# EAGLE board canSlaveV04 (EAGLE 6.5.0)
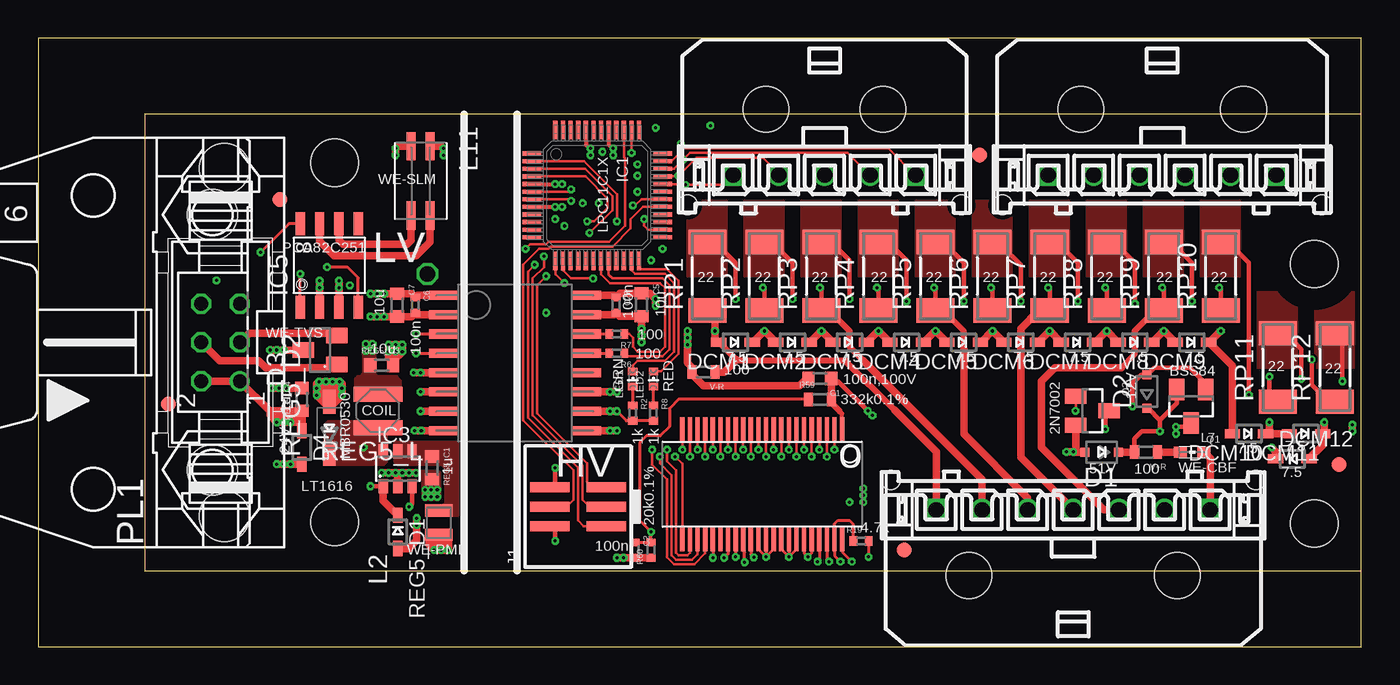
[diagram p5: board, top side]
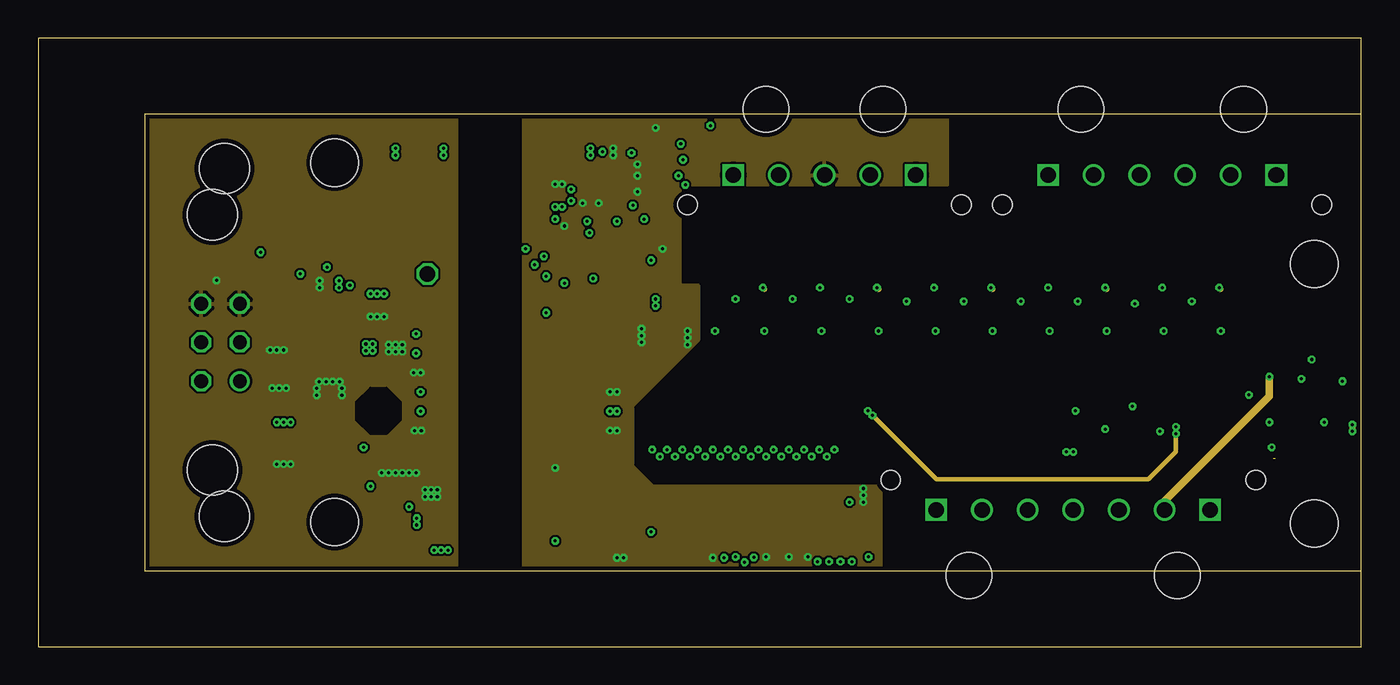
[diagram p6: board, inner layer Route2]
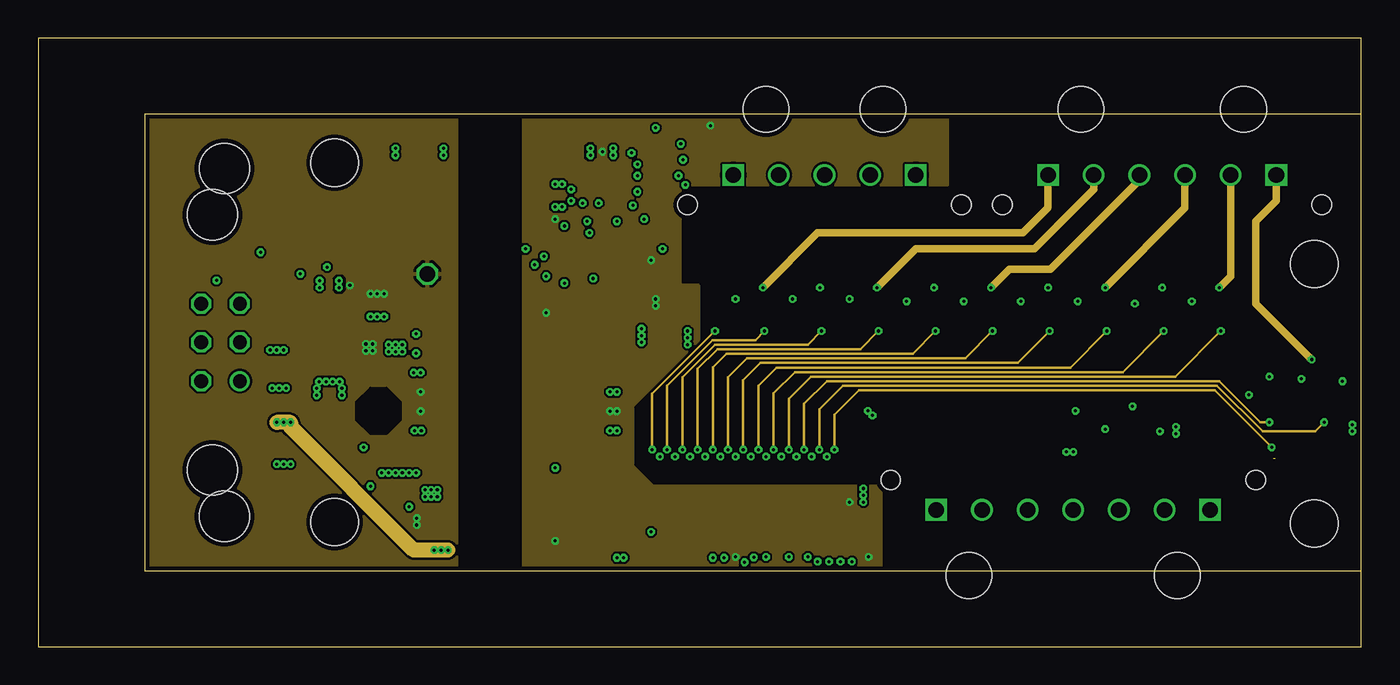
[diagram p7: board, inner layer Route15]
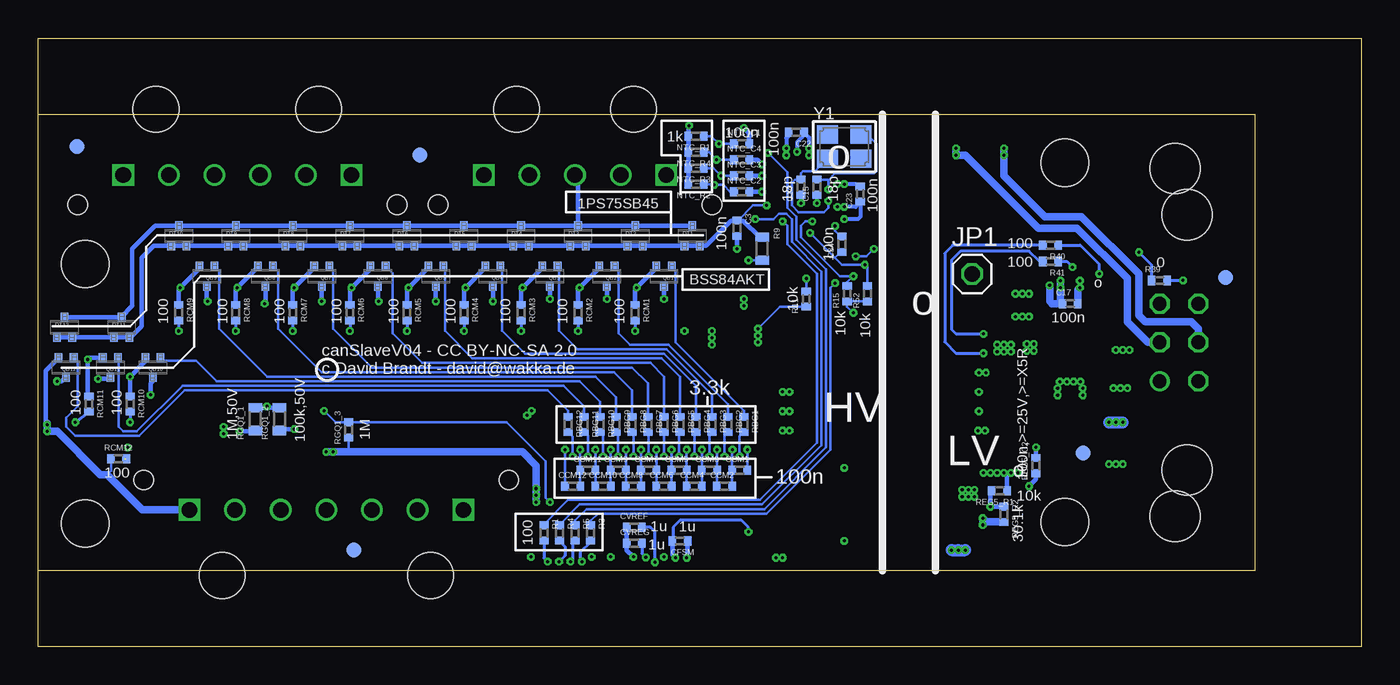
[diagram p8: board, bottom side, seen from below]

Size 87 x 40 mm. Coordinates in mm from the lower left corner, seen from the top.
Outline: 87,5 7,5 7,35 87,35
Outline: 87,5 87,35
Outline: 87,35 87,40 0,40 0,0 87,0 87,5
Copper layers (1+2*15+16): Top 0.035mm / dielectric 0.38mm / Route2 0.035mm / dielectric 0.71mm / Route15 0.035mm / dielectric 0.38mm / Bottom 0.035mm
Design rules "PCB-POOL Standard_ML4 *": minimum track width 0.15mm, minimum drill 0.2mm, track to track 0.15mm, track to pad 0.15mm, pad to pad 0.15mm, via to via 0.15mm, smd to smd 0mil, copper to edge 0.3mm, drill to drill 0.2mm, minimum pad ring 0.2mm, minimum via ring 0.15mm, stop-mask expansion 0.075mm, vias tented up to drill 0.31mm, thermal gap 0.2mm
Holes 3.1 mm at 19.5,8.2 19.5,31.8 83.9,8.1 83.9,25.15
tRestrict: area 16.5,5.2 to 22.5,11.2; area 16.5,28.8 to 22.5,34.8; area 80.9,5.1 to 86.9,11.1; area 80.9,22.1 to 86.9,28.1; 1 lines
bRestrict: area 16.5,5.2 to 22.5,11.2; area 16.5,28.8 to 22.5,34.8; area 80.9,5.1 to 86.9,11.1; area 80.9,22.1 to 86.9,28.1; 1 lines

## Footprints (pad centres in the part's own frame; a part is rotated, then mirrored left to right if it is on the bottom)
C0603 = smd 0.8 x 0.9: 1 -0.75,0; 2 0.75,0
C0402 = smd 0.5 x 0.6: 1 -0.5,0; 2 0.5,0
SOD323-R = smd 0.6 x 0.6: A 1.1,0; C -1.1,0
WE-TVS_SOT23-3L = smd 1 x 1.4: 1 -0.95,-1.1; 2 0.95,-1.1; 3 0,1.1
SOD323 = smd 1 x 0.6: 1 -1.1,0; 2 1.1,0
SOD323-L = smd 1 x 0.6: A 1.1,0; C -1.1,0
SOT416 = smd 0.5 x 0.6: 1 -0.5,-0.65; 2 0.5,-0.65; 3 0,0.65
FIDUCIAL_1MM = smd 1 x 1: 1 0,0
LQFP48 = smd 0.28 x 1.2: 1 -2.75,-4.3; 2 -2.25,-4.3; 3 -1.75,-4.3; 4 -1.25,-4.3; 5 -0.75,-4.3; 6 -0.25,-4.3; 7 0.25,-4.3; 8 0.75,-4.3; 9 1.25,-4.3; 10 1.75,-4.3; 11 2.25,-4.3; 12 2.75,-4.3; 25 2.75,4.3; 26 2.25,4.3; 27 1.75,4.3; 28 1.25,4.3; 29 0.75,4.3; 30 0.25,4.3; 31 -0.25,4.3; 32 -0.75,4.3; 33 -1.25,4.3; 34 -1.75,4.3; 35 -2.25,4.3; 36 -2.75,4.3 | smd 1.2 x 0.28: 13 4.3,-2.75; 14 4.3,-2.25; 15 4.3,-1.75; 16 4.3,-1.25; 17 4.3,-0.75; 18 4.3,-0.25; 19 4.3,0.25; 20 4.3,0.75; 21 4.3,1.25; 22 4.3,1.75; 23 4.3,2.25; 24 4.3,2.75; 37 -4.3,2.75; 38 -4.3,2.25; 39 -4.3,1.75; 40 -4.3,1.25; 41 -4.3,0.75; 42 -4.3,0.25; 43 -4.3,-0.25; 44 -4.3,-0.75; 45 -4.3,-1.25; 46 -4.3,-1.75; 47 -4.3,-2.25; 48 -4.3,-2.75
44SSOP = smd 1.6 x 0.28: 1 -3.6,5.25; 2 -3.6,4.75; 3 -3.6,4.25; 4 -3.6,3.75; 5 -3.6,3.25; 6 -3.6,2.75; 7 -3.6,2.25; 8 -3.6,1.75; 9 -3.6,1.25; 10 -3.6,0.75; 11 -3.6,0.25; 12 -3.6,-0.25; 13 -3.6,-0.75; 14 -3.6,-1.25; 15 -3.6,-1.75; 16 -3.6,-2.25; 17 -3.6,-2.75; 18 -3.6,-3.25; 19 -3.6,-3.75; 20 -3.6,-4.25; 21 -3.6,-4.75; 22 -3.6,-5.25; 23 3.6,-5.25; 24 3.6,-4.75; 25 3.6,-4.25; 26 3.6,-3.75; 27 3.6,-3.25; 28 3.6,-2.75; 29 3.6,-2.25; 30 3.6,-1.75; 31 3.6,-1.25; 32 3.6,-0.75; 33 3.6,-0.25; 34 3.6,0.25; 35 3.6,0.75; 36 3.6,1.25; 37 3.6,1.75; 38 3.6,2.25; 39 3.6,2.75; 40 3.6,3.25; 41 3.6,3.75; 42 3.6,4.25; 43 3.6,4.75; 44 3.6,5.25
SOT23-6 = smd 0.6 x 0.9: 1 -0.95,-1.15; 2 0,-1.15; 3 0.95,-1.15; 4 0.95,1.15; 5 0,1.15; 6 -0.95,1.15
SO-8 = smd 1.524 x 0.61: 1 -2.743,1.905; 2 -2.743,0.635; 3 -2.743,-0.635; 4 -2.743,-1.905; 5 2.743,-1.905; 6 2.743,-0.635; 7 2.743,0.635; 8 2.743,1.905
2X03_1.27MM_SMT = smd 0.65 x 2.6: 1 -1.27,-1.85; 2 -1.27,1.85; 3 0,-1.85; 4 0,1.85; 5 1.27,-1.85; 6 1.27,1.85
1X01 = drill 1.016 octagon: 1 0,0
WE-PMI_0806 = smd 0.8 x 1.8: 1 -0.8,0; 2 0.8,0
0603 = smd 0.85 x 0.7: 1 -0.775,0; 2 0.775,0
WE-SLM = smd 1.85 x 0.6: 1 -2.28,0.63; 2 -2.28,-0.62; 3 2.27,-0.62; 4 2.27,0.63
CHIPLED_0402 = smd 0.6 x 0.5: A 0,-0.5; C 0,0.5
R0402 = smd 0.5 x 0.6: 1 -0.5,0; 2 0.5,0
06V = drill 0.914: 1 -2.54,-1.27 | drill 0.914 octagon: 2 -2.54,1.27; 3 0,-1.27; 4 0,1.27; 5 2.54,-1.27; 6 2.54,1.27 | hole 3.302: 11.43,-0.254; -11.43,-0.254
06H = drill 0.914: 1 -2.54,-1.27 | drill 0.914 octagon: 2 -2.54,1.27; 3 0,-1.27; 4 0,1.27; 5 2.54,-1.27; 6 2.54,1.27 | hole 3.302: -8.382,0.533; 8.382,0.533
SOT23 = smd 1 x 1.4: 1 -0.95,-1.1; 2 0.95,-1.1; 3 0,1.1
R0603 = smd 0.6 x 0.9: 1 -0.75,0; 2 0.75,0
SOD123 = smd 1.6 x 0.8: 1 -1.7,0; 2 1.7,0
WE-TPC_2828 = smd 3.2 x 1: 1 0,1.1; 2 0,-1.1
MINI_MELF-0207R = smd 1.6 x 2.5: 1 -2.25,0; 2 2.25,0
SO16WB = smd 1.9 x 0.6: P$1 -4.7,4.445; P$2 -4.7,3.175; P$3 -4.7,1.905; P$4 -4.7,0.635; P$5 -4.7,-0.635; P$6 -4.7,-1.905; P$7 -4.7,-3.175; P$8 -4.7,-4.445; P$9 4.7,-4.445; P$10 4.7,-3.175; P$11 4.7,-1.905; P$12 4.7,-0.635; P$13 4.7,0.635; P$14 4.7,1.905; P$15 4.7,3.175; P$16 4.7,4.445
43650-0500 = drill 1.02 square: 1 6,4.32 | drill 1.02: 2 3,4.32; 3 0,4.32; 4 -3,4.32; 5 -6,4.32 | hole 3: 3.85,0; -3.85,0
43650-0515 = drill 1.02 square: 1 6,0 | drill 1.02: 2 3,0; 3 0,0; 4 -3,0; 5 -6,0 | hole 1.27: 9,-1.96; -9,-1.96
43650-0700 = drill 1.02 square: 1 9,4.32 | drill 1.02: 2 6,4.32; 3 3,4.32; 4 0,4.32; 5 -3,4.32; 6 -6,4.32; 7 -9,4.32 | hole 3: 6.85,0; -6.85,0
43650-0715 = drill 1.02 square: 1 9,0 | drill 1.02: 2 6,0; 3 3,0; 4 0,0; 5 -3,0; 6 -6,0; 7 -9,0 | hole 1.27: 12,-1.96; -12,-1.96
43650-0615 = drill 1.02 square: 1 7.5,0 | drill 1.02: 2 4.5,0; 3 1.5,0; 4 -1.5,0; 5 -4.5,0; 6 -7.5,0 | hole 1.27: 10.5,-1.96; -10.5,-1.96
43650-0600 = drill 1.02 square: 1 7.5,4.32 | drill 1.02: 2 4.5,4.32; 3 1.5,4.32; 4 -1.5,4.32; 5 -4.5,4.32; 6 -7.5,4.32 | hole 3: 5.35,0; -5.35,0
CRYSTAL_3.2X2.5 = smd 1.4 x 1.2: 1 -1.1,-0.8; 2 1.1,0.8; GND1 -1.1,0.8; GND2 1.1,-0.8

## Placement (x,y rotation side)
C1  100n,100V  [C0603]  51.39,17.63 180 top
C2  100n  [C0402]  39.25,6.35 270 top
C3  100n  [C0402]  41.05,27.5 270 bottom
C5  10u  [C0603]  39.67,22.48 270 top
C6  100n  [C0402]  24.8,22.45 270 top
C7  10u  [C0603]  23.6,22.45 270 top
C14  18p  [C0402]  36.85,30.2 90 bottom
C15  18p  [C0402]  35.8,30.2 90 bottom
C17  100n  [C0402]  19.15,22.55 0 bottom
C22  100n  [C0402]  37.15,33.8 180 bottom
C23  100n  [C0402]  32.95,29.75 90 bottom
C27  100n  [C0402]  38,22.45 270 top
C34  100n  [C0402]  34.15,26.45 90 bottom
CCM1  100n  [C0402]  40.88,11.6 0 bottom
CCM2  100n  [C0402]  41.88,10.55 0 bottom
CCM3  100n  [C0402]  42.86,11.6 0 bottom
CCM4  100n  [C0402]  43.86,10.55 0 bottom
CCM5  100n  [C0402]  44.86,11.6 0 bottom
CCM6  100n  [C0402]  45.86,10.55 0 bottom
CCM7  100n  [C0402]  46.86,11.6 0 bottom
CCM8  100n  [C0402]  47.86,10.55 0 bottom
CCM9  100n  [C0402]  48.86,11.6 0 bottom
CCM10  100n  [C0402]  49.86,10.55 0 bottom
CCM11  100n  [C0402]  50.86,11.6 0 bottom
CCM12  100n  [C0402]  51.86,10.55 0 bottom
CFSM  1u  [C0402]  44.8,6.95 180 bottom
CVREF  1u  [C0402]  47.8,7.85 0 bottom
CVREG  1u  [C0402]  47.8,6.8 0 bottom
D1  51V  [SOD323-R]  69.91,12.78 180 top
D2  12V  [SOD323-R]  72.89,16.76 90 top
D3  WE-TVS_824022  [WE-TVS_SOT23-3L]  18.55,19.5 90 top
D4  24V  [SOD323]  17.35,13.1 270 top
DCM1  7.5  [SOD323-L]  45.85,20 180 top
DCM2  7.5  [SOD323-L]  49.6,20 180 top
DCM3  7.5  [SOD323-L]  53.35,20 180 top
DCM4  7.5  [SOD323-L]  57.1,20 180 top
DCM5  7.5  [SOD323-L]  60.85,20 180 top
DCM6  7.5  [SOD323-L]  64.6,20 180 top
DCM7  7.5  [SOD323-L]  68.35,20 180 top
DCM8  7.5  [SOD323-L]  72.1,20 180 top
DCM9  7.5  [SOD323-L]  75.85,20 180 top
DCM10  7.5  [SOD323-L]  79.6,14 180 top
DCM11  7.5  [SOD323-L]  83.35,14 180 top
DCM12  7.5  [SOD323-L]  82.45,12.35 0 top
DT1  1PS75SB45  [SOT416]  44,27 0 bottom
DT2  1PS75SB45  [SOT416]  47.75,27 0 bottom
DT3  1PS75SB45  [SOT416]  51.5,27 0 bottom
DT4  1PS75SB45  [SOT416]  55.25,27 0 bottom
DT5  1PS75SB45  [SOT416]  59,27 0 bottom
DT6  1PS75SB45  [SOT416]  62.75,27 0 bottom
DT7  1PS75SB45  [SOT416]  66.5,27 0 bottom
DT8  1PS75SB45  [SOT416]  70.25,27 0 bottom
DT9  1PS75SB45  [SOT416]  74,27 0 bottom
DT10  1PS75SB45  [SOT416]  77.75,27 0 bottom
DT11  1PS75SB45  [SOT416]  81.5,21 0 bottom
DT12  1PS75SB45  [SOT416]  85.25,21 0 bottom
FID1  FIDUCIAL""  [FIDUCIAL_1MM]  15.9,29.39 0 top
FID2  FIDUCIAL""  [FIDUCIAL_1MM]  8.58,15.96 0 top
FID3  FIDUCIAL""  [FIDUCIAL_1MM]  85.52,11.98 0 top
FID4  FIDUCIAL""  [FIDUCIAL_1MM]  61.9,32.3 0 top
FID5  FIDUCIAL""  [FIDUCIAL_1MM]  56.95,6.35 0 top
FID6  FIDUCIAL""  [FIDUCIAL_1MM]  18.29,12.74 270 bottom
FID7  FIDUCIAL""  [FIDUCIAL_1MM]  84.43,32.87 0 bottom
FID8  FIDUCIAL""  [FIDUCIAL_1MM]  8.92,24.26 0 bottom
FID9  FIDUCIAL""  [FIDUCIAL_1MM]  61.9,32.3 0 bottom
FID10  FIDUCIAL""  [FIDUCIAL_1MM]  66.25,6.35 0 bottom
IC1  LPC11C1X  [LQFP48]  36.76,29.66 270 top
IC2  LTC6803-4  [44SSOP]  47.61,10.67 270 top
IC3  LT1616  [SOT23-6]  23.65,11.7 0 top
IC5  PCA82C251  [SO-8]  19.15,25.06 90 top
J1  PINHEAD-2X031.27SMT  [2X03_1.27MM_SMT]  35.5,9.2 90 top
JP1  [1X01]  25.6,24.5 0 bottom
L2  WE-PMI_0806  [WE-PMI_0806]  26.35,8.15 90 top
L7  WE-CBF_0603  [0603]  75.87,12.78 180 top
L11  WE-SLM  [WE-SLM]  25.15,30.61 270 top
LED1  GRN  [CHIPLED_0402]  39.1,17.6 0 top
LED2  RED  [CHIPLED_0402]  40.45,17.6 0 top
NTC_C1  100n  [C0402]  40.75,33.05 0 bottom
NTC_C2  100n  [C0402]  40.75,29.9 0 bottom
NTC_C3  100n  [C0402]  40.75,30.95 0 bottom
NTC_C4  100n  [C0402]  40.75,32 0 bottom
NTC_R1  1k  [R0402]  43.75,33.55 180 bottom
NTC_R2  1k  [R0402]  43.75,30.4 180 bottom
NTC_R3  1k  [R0402]  43.75,31.45 180 bottom
NTC_R4  1k  [R0402]  43.75,32.5 180 bottom
PL1  [06V]  12,20 90 top
PL2  [06H]  12,20 90 top
Q1  BSS84  [SOT23]  75.8,15.81 180 top
Q2  2N7002  [SOT23]  69.32,15.51 270 top
QB1  BSS84AKT  [SOT416]  45.85,24.35 180 bottom
QB2  BSS84AKT  [SOT416]  49.6,24.35 180 bottom
QB3  BSS84AKT  [SOT416]  53.35,24.35 180 bottom
QB4  BSS84AKT  [SOT416]  57.1,24.35 180 bottom
QB5  BSS84AKT  [SOT416]  60.85,24.35 180 bottom
QB6  BSS84AKT  [SOT416]  64.65,24.35 180 bottom
QB7  BSS84AKT  [SOT416]  68.35,24.35 180 bottom
QB8  BSS84AKT  [SOT416]  72.05,24.35 180 bottom
QB9  BSS84AKT  [SOT416]  75.9,24.35 180 bottom
QB10  BSS84AKT  [SOT416]  79.45,18.35 180 bottom
QB11  BSS84AKT  [SOT416]  82.25,18.35 180 bottom
QB12  BSS84AKT  [SOT416]  85.15,18.35 180 bottom
R1  100  [R0402]  53.74,7.48 270 bottom
R2  1k  [R0402]  39.1,15.35 270 top
R3  100  [R0402]  50.68,7.48 270 bottom
R4  100  [R0402]  52.72,7.48 270 bottom
R5  100  [R0402]  51.7,7.48 270 bottom
R6  100  [R0402]  38.05,19.29 180 top
R7  100  [R0402]  38.05,20.55 180 top
R8  1k  [R0402]  40.45,15.35 270 top
R9  [R0603]  39.4,26.15 270 bottom
R11  10k  [R0402]  36.5,22.85 90 bottom
R15  10k  [R0402]  33.81,23.2 90 bottom
R19  4.7k  [R0402]  54.1,6.95 0 top
R39  0  [R0402]  13.29,24.07 0 bottom
R40  100  [R0402]  20.44,26.39 180 bottom
R41  100  [R0402]  20.44,25.32 180 bottom
R52  10k  [R0402]  32.48,23.2 90 bottom
R59  332k0.1%  [R0603]  51.4,16.25 0 top
R60  20k0.1%  [R0402]  40.3,6.35 90 top
RBG1  3.3k  [R0402]  40.6,14.6 270 bottom
RBG2  3.3k  [R0402]  41.65,14.6 270 bottom
RBG3  3.3k  [R0402]  42.7,14.6 270 bottom
RBG4  3.3k  [R0402]  43.75,14.6 270 bottom
RBG5  3.3k  [R0402]  44.8,14.6 270 bottom
RBG6  3.3k  [R0402]  45.85,14.6 270 bottom
RBG7  3.3k  [R0402]  46.9,14.6 270 bottom
RBG8  3.3k  [R0402]  47.95,14.6 270 bottom
RBG9  3.3k  [R0402]  49,14.6 270 bottom
RBG10  3.3k  [R0402]  50.05,14.6 270 bottom
RBG11  3.3k  [R0402]  51.1,14.6 270 bottom
RBG12  3.3k  [R0402]  52.15,14.6 270 bottom
RCM1  100  [R0402]  47.75,21.95 270 bottom
RCM2  100  [R0402]  51.5,21.95 270 bottom
RCM3  100  [R0402]  55.25,21.95 270 bottom
RCM4  100  [R0402]  59,21.95 270 bottom
RCM5  100  [R0402]  62.75,21.95 270 bottom
RCM6  100  [R0402]  66.5,21.95 270 bottom
RCM7  100  [R0402]  70.25,21.95 270 bottom
RCM8  100  [R0402]  74,21.95 270 bottom
RCM9  100  [R0402]  77.75,21.95 270 bottom
RCM10  100  [R0402]  80.95,15.95 270 bottom
RCM11  100  [R0402]  83.65,15.95 270 bottom
RCM12  100  [R0402]  81.7,12.35 0 bottom
REG5_C1  1u,>=25V,>=X5R  [C0603]  25.9,11.75 270 top
REG5_C2  100n,>=25V,>=X5R  [C0402]  21.4,11.9 90 bottom
REG5_C3  10u,>=10V,>=X5R  [C0603]  22.6,18.5 0 top
REG5_C4  1u,>=25V,>=X5R  [C0603]  17.35,16.25 90 top
REG5_D1  [SOD323]  23.65,7.55 270 top
REG5_D2  MBR0530  [SOD123]  19.15,14.4 90 top
REG5_L  744025100  [WE-TPC_2828]  22.35,15.5 180 top
REG5_R1  10k  [R0402]  23.8,10.25 180 bottom
REG5_R2  30.1k  [R0402]  23.5,8.7 270 bottom
RGQ1_1  1M,50V  [R0603]  72.72,14.96 90 bottom
RGQ1_2  100k,50V  [R0603]  71.12,14.96 90 bottom
RGQ1_3  1M  [R0402]  66.57,14.25 90 bottom
RP1  22  [MINI_MELF-0207R]  44,24.35 90 top
RP2  22  [MINI_MELF-0207R]  47.75,24.35 90 top
RP3  22  [MINI_MELF-0207R]  51.5,24.35 90 top
RP4  22  [MINI_MELF-0207R]  55.25,24.35 90 top
RP5  22  [MINI_MELF-0207R]  59,24.35 90 top
RP6  22  [MINI_MELF-0207R]  62.75,24.35 90 top
RP7  22  [MINI_MELF-0207R]  66.5,24.35 90 top
RP8  22  [MINI_MELF-0207R]  70.25,24.35 90 top
RP9  22  [MINI_MELF-0207R]  74,24.35 90 top
RP10  22  [MINI_MELF-0207R]  77.75,24.35 90 top
RP11  22  [MINI_MELF-0207R]  81.5,18.35 90 top
RP12  22  [MINI_MELF-0207R]  85.25,18.35 90 top
U$2  ADUM5201  [SO16WB]  31.35,18.65 0 top
V+R  100  [R0603]  72.83,12.79 180 top
V-R  100  [R0603]  43.75,18.05 180 top
X1  [43650-0500]  51.7,35.32 180 top
X2  [43650-0515]  51.7,31 0 top
X3  [43650-0700]  68.05,4.68 0 top
X4  [43650-0715]  68.05,9 180 top
X5  [43650-0615]  73.9,31 0 top
X6  [43650-0600]  73.9,35.32 180 top
Y1  [CRYSTAL_3.2X2.5]  34,32.87 0 bottom

## Tracks (layer width: path | path; a pad name or v marks a point on that pad's centre or on a via)
!RESET  (via drill 0.2)
  Top 0.15: J1.1 35.87,7.93 35.5,8.3 35.5,11.75 32.2,15.05 32.2,24.65 v32.65,25.1 | v36.25,27.2 37.75,28.7 37.75,29.6 35.94,31.41 IC1.3
  Bottom 0.15: R52.2 32.48,24.93 v32.65,25.1 34.15,25.1 34.6,25.55 | 34.6,25.55 v36.25,27.2 | C34.1 34.2,25.95 34.6,25.55
+3V3  (via drill 0.2)
  Top 0.15: Q2.1 68.22,15.52 v68.2,15.5
  Top 0.2: IC2.30 v45.86,5.9 | R19.2 v54.6,5.9 | R8.2 R2.2 38.67,14.85 v38.05,15.47
  Top 0.27: IC1.44 36.01,32.99 36.25,32.75 v36.31,32.75 v36.31,32.3 | IC1.8 v34,28.91 v34.45,28.91
  Top 0.3: J1.2 33.92,7.93 34,7.85 v34,6.95
  Top 0.5: U$2.P$16 37.86,23.09 C27.1 38.27,23.23 C5.1 40.23,23.23 v40.6,22.85 v40.6,22.4 | U$2.P$10 v37.6,15.47 v38.05,15.47
  Bottom 0.15: R52.1 R15.1 33.81,22.36 v33.4,21.95 | v53.35,9.5 53.65,9.8 53.65,12.2 56.2,14.75 RGQ1_3.2 67.45,14.75 v68.2,15.5 | R9.2 v40.3,25.4
  Bottom 0.27: v36.31,32.3 36.31,33.45 36.65,33.79 C22.1 36.65,33.6 37.1,33.15 v37.1,32.52 | v34.45,28.91 33.25,28.91 32.95,29.21 C23.1 32.95,28.25 33.1,28.1 v34,28.1
  Bottom 0.3: NTC_R2.2 NTC_R3.2 NTC_R4.2 NTC_R1.2 44.25,34.2 v44.2,34.25
  pour Route15: 31.9,5 55.45,5 55.45,10.55 40.45,10.55 39.1,11.9 39.1,15.8 43.45,20.15 43.45,23.75 42.25,23.75 42.25,30.35 59.8,30.35 59.8,35 31.9,35
AD0  (via drill 0.2)
  Top 0.15: IC1.32 42.49,30.41 v42.55,30.35 44.95,30.35 45.6,31 X1.1
  Bottom 0.15: NTC_C2.1 41.5,29.9 41.95,30.35 v42.55,30.35 42.6,30.4 NTC_R2.1
AD1  (via drill 0.2)
  Top 0.15: IC1.33 42.06,30.91 v42.1,30.95 43.3,32.15 47.65,32.15 48.7,31.1 X1.2
  Bottom 0.15: NTC_C3.1 v42.1,30.95 42.6,31.45 NTC_R3.1
AD2  (via drill 0.2)
  Top 0.15: IC1.34 41.81,31.41 v42.4,32 42.85,32.45 53.2,32.45 54.65,31 X1.4
  Bottom 0.15: NTC_C4.1 v42.4,32 42.9,32.5 NTC_R4.1
AD3  (via drill 0.2)
  Top 0.15: v42.25,33.05 42.25,32.9 | X1.5 57.65,31 55.9,32.75 42.55,32.75 v42.25,33.05 | IC1.35 41.63,31.91 42.12,32.4 42.12,32.92 v42.25,33.05
  Bottom 0.15: NTC_C1.1 v42.25,33.05 42.75,33.55 NTC_R1.1
BAL1  (via drill 0.2)
  Top 0.15: IC2.25 43.36,6.08 43,5.72 41.95,5.72 41.65,6.03 41.65,11.28 40.88,12.05 v40.88,12.5
  Bottom 0.15: v40.88,12.5 40.88,13.82 RBG1.2
BAL2  (via drill 0.2)
  Top 0.15: IC2.23 42.36,12.02 v41.88,12.5
  Bottom 0.15: v41.88,12.5 41.88,13.88 RBG2.2
BAL3  (via drill 0.2)
  Top 0.15: IC2.21 v42.86,12.5
  Bottom 0.15: v42.86,12.5 42.86,13.94 RBG3.2
BAL4  (via drill 0.2)
  Top 0.15: IC2.19 v43.86,12.5
  Bottom 0.15: v43.86,12.5 43.86,13.99 RBG4.2
BAL5  (via drill 0.2)
  Top 0.15: IC2.17 v44.86,12.5
  Bottom 0.15: v44.86,12.5 44.86,14.04 RBG5.2
BAL6  (via drill 0.2)
  Top 0.15: IC2.15 v45.86,12.5
  Bottom 0.15: v45.86,12.5 RBG6.2
BAL7  (via drill 0.2)
  Top 0.15: IC2.13 v46.86,12.5
  Bottom 0.15: v46.86,12.5 46.86,14.06 RBG7.2
BAL8  (via drill 0.2)
  Top 0.15: IC2.11 v47.86,12.5
  Bottom 0.15: v47.86,12.5 47.86,14.01 RBG8.2
BAL9  (via drill 0.2)
  Top 0.15: IC2.9 v48.86,12.5
  Bottom 0.15: v48.86,12.5 48.86,13.96 RBG9.2
BAL10  (via drill 0.2)
  Top 0.15: IC2.7 v49.86,12.5
  Bottom 0.15: v49.86,12.5 49.86,13.91 RBG10.2
BAL11  (via drill 0.2)
  Top 0.15: IC2.5 v50.86,12.5
  Bottom 0.15: v50.86,12.5 50.86,13.86 RBG11.2
BAL12  (via drill 0.2)
  Top 0.15: IC2.3 v51.86,12.5
  Bottom 0.15: v51.86,12.5 51.86,13.81 RBG12.2
BOOST1  (via drill 0.2)
  Top 0.3: IC3.1 v21.85,10.55
  Top 0.5: IC3.1 22.7,9.6 REG5_D1.1
  Bottom 0.3: REG5_C2.1 21.4,11 v21.85,10.55
C0  (via drill 0.2)
  Top 0.15: IC2.26 43.86,6.13 43.15,5.42 41.8,5.42 41.35,5.88 41.35,11 40.38,11.97 v40.38,12.95
  Top 0.3: 44.5,21.6 RP1.1 | 44.5,20.25 DCM1.A
  Top 0.4: 56.33,15.53 53.05,18.8 45.95,18.8 45.9,18.85 DCM1.A
  Top 0.5: 44.5,21.6 v44.5,20.75 44.5,20.25 | V-R.1 45.1,18.05 45.9,18.85 | X3.7 59.05,12.8 56.33,15.53
  Route15 0.15: v40.38,12.95 40.38,16.62 v44.5,20.75
  Bottom 0.15: CCM1.2 v40.38,12.95
C1  (via drill 0.2)
  Top 0.3: RP2.1 47.75,23.5 v47.65,23.6
  Route2 0.4: 47.75,23.5 v47.65,23.6
  Route15 0.5: X6.1 66.4,28.85 64.75,27.2 51.25,27.2 v47.65,23.6
  Bottom 0.3: QB1.2 46.35,24.9 v47.65,23.6 47.75,23.5 RCM1.1
C1M  (via drill 0.2)
  Top 0.15: IC2.24 42.86,6.18 42.7,6.03 42.1,6.03 41.95,6.17 41.95,11.6 41.35,12.2 v41.35,12.95
  Top 0.2: DCM1.C 47,20
  Top 0.5: 47,20 v47.75,20.75 DCM2.A
  Route15 0.15: v41.35,12.95 41.35,17.15 44.35,20.15 47.15,20.15 v47.75,20.75
  Bottom 0.15: v41.35,12.95 41.38,12.93 CCM1.1 CCM2.2
  Bottom 0.2: RCM1.2 v47.75,20.75
C2  (via drill 0.2)
  Top 0.3: RP3.1 51.5,23.5 v51.4,23.6
  Top 0.4: 54.25,18.8 53.35,19.7 53.35,20.75 52,22.1 RP3.1
  Top 0.5: X3.6 62.05,11 54.25,18.8
  Bottom 0.3: QB2.2 50.1,24.9 v51.4,23.6 51.5,23.5 RCM2.1
C2M  (via drill 0.2)
  Top 0.15: IC2.22 v42.36,12.95
  Top 0.2: DCM2.C 50.75,20
  Top 0.5: 50.75,20 v51.5,20.75 DCM3.A
  Route15 0.15: v42.36,12.95 42.36,17.71 44.5,19.85 50.6,19.85 v51.5,20.75
  Bottom 0.15: CCM2.1 42.38,11.58 CCM3.2 v42.36,12.95
  Bottom 0.2: RCM2.2 v51.5,20.75
C3  (via drill 0.2)
  Top 0.3: RP4.1 55.25,23.5 v55.15,23.6
  Route2 0.4: 55.25,23.5 v55.15,23.6
  Route15 0.5: X6.2 69.4,30.05 65.5,26.15 57.7,26.15 v55.15,23.6
  Bottom 0.3: QB3.2 53.85,24.9 v55.15,23.6 55.25,23.5 RCM3.1
C3M  (via drill 0.2)
  Top 0.15: IC2.20 v43.36,12.95
  Top 0.2: DCM3.C 54.5,20
  Top 0.5: 54.5,20 v55.25,20.75 DCM4.A
  Route15 0.15: v43.36,12.95 43.36,18.26 44.65,19.55 54.05,19.55 v55.25,20.75
  Bottom 0.15: CCM4.2 CCM3.1 v43.36,12.95
  Bottom 0.2: RCM3.2 v55.25,20.75
C4  (via drill 0.2)
  Top 0.3: RP5.1 59,23.5 v58.9,23.6
  Top 0.4: 60.85,19.55 60.85,20.75 59.5,22.1 RP5.1
  Top 0.5: 60.85,19.55 60.85,14 65.05,9.8 X3.5
  Bottom 0.3: QB4.2 57.6,24.9 v58.9,23.6 59,23.5 RCM4.1
C4M  (via drill 0.2)
  Top 0.15: IC2.18 v44.36,12.95
  Top 0.2: DCM4.C 58.25,20
  Top 0.5: 58.25,20 v59,20.75 DCM5.A
  Route15 0.15: v44.36,12.95 44.36,18.36 45.25,19.25 57.5,19.25 v59,20.75
  Bottom 0.15: CCM4.1 CCM5.2 v44.36,12.95
  Bottom 0.2: RCM4.2 v59,20.75
C5  (via drill 0.2)
  Top 0.3: RP6.1 62.75,23.5 v62.65,23.6
  Route2 0.4: 62.75,23.5 v62.65,23.6
  Route15 0.5: X6.3 72.4,30.65 66.55,24.8 63.85,24.8 v62.65,23.6
  Bottom 0.3: QB5.2 61.35,24.9 v62.65,23.6 62.75,23.5 RCM5.1
C5M  (via drill 0.2)
  Top 0.15: IC2.16 v45.36,12.95
  Top 0.2: DCM5.C 62,20
  Top 0.5: 62,20 v62.75,20.75 DCM6.A
  Route15 0.15: v45.36,12.95 45.36,17.71 46.6,18.95 60.95,18.95 v62.75,20.75
  Bottom 0.15: CCM6.2 CCM5.1 v45.36,12.95
  Bottom 0.2: RCM5.2 v62.75,20.75
C6  (via drill 0.2)
  Top 0.3: RP7.1 66.5,23.5 v66.4,23.6
  Top 0.4: RP7.1 67,22.1
  Top 0.5: 67,22.1 65.8,22.1 64.6,20.9 64.6,12.45 X3.4
  Bottom 0.3: QB6.2 65.15,24.85 v66.4,23.6 66.5,23.5 RCM6.1
C6M  (via drill 0.2)
  Top 0.15: IC2.14 v46.36,12.95
  Top 0.2: DCM6.C 65.75,20
  Top 0.5: 65.75,20 v66.5,20.75 DCM7.A
  Route15 0.15: v46.36,12.95 46.36,17.51 47.5,18.65 64.4,18.65 v66.5,20.75
  Bottom 0.15: CCM6.1 CCM7.2 v46.36,12.95
  Bottom 0.2: RCM6.2 v66.5,20.75
C7  (via drill 0.2)
  Top 0.3: RP8.1 70.25,23.5 v70.15,23.6
  Route2 0.4: 70.25,23.5 v70.15,23.6
  Route15 0.5: X6.4 75.4,28.85 v70.15,23.6
  Bottom 0.3: QB7.2 68.85,24.9 v70.15,23.6 70.25,23.5 RCM7.1
C7M  (via drill 0.2)
  Top 0.15: IC2.12 v47.36,12.95
  Top 0.2: DCM7.C 69.5,20
  Top 0.5: DCM8.A v70.25,20.75 69.5,20
  Route15 0.15: v47.36,12.95 47.36,15.34 | 47.36,15.34 47.35,15.35 | 47.36,15.34 47.36,17.16 48.55,18.35 67.85,18.35 v70.25,20.75
  Bottom 0.15: CCM8.2 CCM7.1 v47.36,12.95
  Bottom 0.2: RCM7.2 v70.25,20.75
C8  (via drill 0.2)
  Top 0.3: RP9.1 74,23.5 v73.9,23.6
  Top 0.4: 71.2,18.35 72.1,19.25 72.1,20.75 73.45,22.1 RP9.1
  Top 0.5: X3.3 70.05,9 65.95,13.1 65.95,17.45 66.85,18.35 71.2,18.35
  Bottom 0.3: QB8.2 72.55,24.95 v73.9,23.6 74,23.5 RCM8.1
C8M  (via drill 0.2)
  Top 0.15: IC2.10 v48.36,12.95
  Top 0.2: DCM8.C 73.25,20
  Top 0.5: 73.25,20 v74,20.75 DCM9.A
  Route15 0.15: v48.36,12.95 48.36,16.66 49.75,18.05 71.3,18.05 v74,20.75
  Bottom 0.15: CCM8.1 CCM9.2 v48.36,12.95
  Bottom 0.2: RCM8.2 v74,20.75
C9  (via drill 0.2)
  Top 0.3: RP10.1 77.75,23.5 v77.65,23.6
  Route2 0.4: 77.75,23.5 v77.65,23.6
  Route15 0.5: X6.5 78.4,24.35 v77.65,23.6
  Bottom 0.3: QB9.2 76.4,24.85 v77.65,23.6 77.75,23.5 RCM9.1
C9M  (via drill 0.2)
  Top 0.15: IC2.8 v49.36,12.95
  Top 0.5: v77.75,20.75 77,20 DCM9.C 78.5,18.45 DCM10.A
  Route15 0.15: v49.36,12.95 49.36,16.31 50.8,17.75 74.75,17.75 v77.75,20.75
  Bottom 0.15: v49.36,12.95 CCM9.1 CCM10.2
  Bottom 0.2: RCM9.2 v77.75,20.75
C10  (via drill 0.2)
  Top 0.3: 80.95,16.1 v80.95,17.75
  Top 0.5: RP11.1 80.95,16.1
  Route2 0.5: X3.2 74.05,9.55 RCM10.1 v80.95,17.75
  Bottom 0.3: QB10.2 79.95,18.75 v80.95,17.75 RCM10.1
C10M  (via drill 0.2)
  Top 0.15: IC2.6 v50.36,12.95
  Top 0.2: 80.95,14.25 DCM10.C
  Top 0.5: v80.95,14.75 80.95,14.25 | DCM11.A DCM10.C
  Route15 0.15: v50.36,12.95 50.36,15.96 51.85,17.45 77.65,17.45 80.35,14.75 v80.95,14.75
  Bottom 0.15: CCM10.1 CCM11.2 v50.36,12.95
  Bottom 0.2: RCM10.2 v80.95,14.75
C11  (via drill 0.2)
  Top 0.3: 84.55,15.95 84.55,16.4 83.72,17.23 v83.72,18.88
  Top 0.5: 84.55,15.95 85.1,15.95 RP12.1
  Route2 0.4: 83.7,18.85 v83.72,18.88
  Route15 0.5: X6.6 81.4,29.3 80.05,27.95 80.05,22.55 v83.72,18.88
  Bottom 0.3: QB11.2 83.6,19 v83.72,18.88 83.72,16.45 RCM11.1
C11M  (via drill 0.2)
  Top 0.15: IC2.4 v51.36,12.95
  Top 0.2: 84.55,14.1 DCM11.C
  Top 0.5: v84.55,14.75 84.55,14.1 | DCM11.C 84.45,13.25 DCM12.A
  Route15 0.15: v51.36,12.95 51.36,15.61 52.9,17.15 77.5,17.15 80.5,14.15 83.95,14.15 v84.55,14.75
  Bottom 0.15: CCM12.2 CCM11.1 v51.36,12.95
  Bottom 0.2: RCM11.2 v84.55,14.75
C12  (via drill 0.2)
  Top 0.5: v86.4,14.6 v86.4,14.15 | X3.1 77.05,12.37 L7.1
  Route2 0.4: v86.4,14.6 v86.4,14.15
  Bottom 0.15: RCM12.1 82.2,11.55 82.45,11.3
  Bottom 0.3: v86.4,14.6 86.5,14.75 86.5,18.15 QB12.2
  Bottom 0.5: v86.4,14.15 v86.4,14.6 | v86.4,14.15 86.4,14.7 | v86.4,14.15 85.75,14.15 82.9,11.3 82.45,11.3 80.14,9 X3.1
C12M  (via drill 0.2)  (1 unrouted)
  Top 0.15: IC2.2 v52.36,12.95
  Top 0.5: DCM12.C 81.35,12.85 v81.1,13.1
  Route15 0.15: v52.36,12.95 52.36,15.26 53.95,16.85 77.35,16.85 v81.1,13.1
  Bottom 0.15: CCM12.1 v52.36,12.95
CANH  (via drill 0.2)
  Top 0.5: L11.1 26.51,32.89 v26.65,32.75 v26.65,32.3 | D3.2 19.45,20.45 19.3,20.6 13.87,20.6 PL2.3
  Bottom 0.5: v26.65,32.75 v26.65,32.3 26.05,32.3 21.25,27.5 18.7,27.5 15.4,24.2 15.4,21.35 14.05,20 PL2.3
CANL  (via drill 0.2)
  Top 0.5: L11.2 23.64,32.89 v23.5,32.75 v23.5,32.3 | D3.1 19.65,18.4 19.6,18.35 14.95,18.35 14.5,18.8 11.93,18.8 PL2.4
  Bottom 0.5: v23.5,32.75 23.5,30.95 20.8,28.25 18.4,28.25 14.65,24.5 14.65,21.8 14.2,21.35 11.2,21.35 10.73,20.88 PL2.4
CANRX
  Top 0.2: U$2.P$14 37.7,20.55 R7.2
CANRX_U_L
  Top 0.15: IC1.19 37.01,24.49 37.6,23.9 40.9,23.9 41.2,23.6 41.2,19.7 40.9,19.4 39.4,19.4 39.1,19.7 39.1,20.3 38.84,20.55 R7.1
CANTX
  Top 0.2: U$2.P$13 R6.2
CANTX_U_L
  Top 0.15: IC1.20 37.51,24.44 37.75,24.2 41.05,24.2 41.5,23.75 41.5,19.55 41.05,19.1 38.74,19.1 R6.1
CAR+5V  (via drill 0.2)
  Top 0.5: U$2.P$1 24.95,23.09 C6.1 24.55,23.2 C7.1 v22.75,23.2 v22.3,23.2 v21.85,23.2 | U$2.P$7 v25.15,15.47 | U$2.P$6 v25.15,16.74 | IC5.3 v19.79,23.6 v19.79,24.05 | 23.65,6.55 REG5_D1.2 24.35,6.45 24.9,7 v24.9,8 v24.9,8.45
  Bottom 0.5: v20.5,23.75 20.5,22.7 20.35,22.55 C17.1 19.75,22.65 19.75,22.7 19.79,22.73 v19.79,24.05 | REG5_R2.2 24.7,8.2 v24.9,8 v24.9,8.45 24.68,8.22
  other vias: 21.55,19.45 22,19.45 22,19.89 21.55,19.89
  pour Route15: 7,5 27.55,5 27.55,35 7,35
  pour Top (rank 4, no thermals): 20.85,16.2 23.85,16.2 23.85,17.48 23.57,17.75 22.3,17.75 22.15,17.9 22.15,19.95 22.05,20.05 21.5,20.05 21.38,19.93 21.38,17.93 21.2,17.75 21,17.75 20.85,17.6
CAR_CANRX  (via drill 0.2)
  Top 0.2: v24.85,20.55 U$2.P$3
  Bottom 0.2: R41.2 21.17,25.32 21.85,26 26.35,26 26.95,25.4 26.95,20.86 U$2.P$3 v24.85,20.55
CAR_CANRX_T  (via drill 0.2)
  Top 0.2: IC5.4 21.05,24.25 20.35,24.95 v19,24.95
  Bottom 0.2: R41.1 19.37,25.32 v19,24.95
CAR_CANTX  (via drill 0.2)
  Top 0.2: v24.85,19.29 U$2.P$4
  Bottom 0.2: R40.2 26.86,26.39 27.4,25.85 27.4,20.04 U$2.P$4 v24.85,19.29
CAR_CANTX_T  (via drill 0.2)
  Top 0.2: IC5.1 v17.24,24.5
  Bottom 0.2: R40.1 18.49,26.39 17.24,25.14 v17.24,24.5
CARGND  (via drill 0.2)
  Top 0.5: D3.3 v16.15,19.5 v15.7,19.5 v15.25,19.5 | U$2.P$8 v25.2,14.21 v24.75,14.21 | U$2.P$5 v25.15,18.02 v24.7,18.02 | IC5.2 v18.52,23.6 v18.52,24.05 | U$2.P$2 24.93,21.82 C6.2 24.55,21.7 C7.2 v22.75,21.7 v22.3,21.7 v21.85,21.7 | REG5_C4.2 v16.3,17 v15.85,17 v15.4,17 | D4.2 v16.6,12 v16.15,12 v15.7,12 | 23.2,18.8 23.05,18.95 v23.05,19.85 v23.5,19.85 | v23.5,19.85 v23.95,19.85 v23.95,19.4 23.35,18.8 REG5_C3.2 | 23.5,19.1 v23.5,19.85 | IC3.2 23.65,11.38 | 23.65,11.38 23.65,11.43 | v23.5,11.43 23.65,11.38 | v22.6,11.43 v24.85,11.43 | v18.32,16.52 v18.32,16.98 | v18.32,16.98 18.32,17.27 v18.48,17.43 v19.82,17.43 19.98,17.27 v19.98,16.98 | v19.98,16.52 v19.98,16.98 | v18.32,16.52 v19.98,16.52 | v19.98,16.98 v18.32,16.98 | v18.32,16.52 18.98,15.88 18.98,15.93 REG5_D2.2 | v19.98,16.52 19.32,15.88
  Bottom 0.2: R39.2 v11.73,24.07
  Bottom 0.3: REG5_R1.1 23.3,11.43 v23.5,11.43
  Bottom 0.5: C17.2 18.65,23.46 v18.52,23.6
  other vias: 23.05,19.4 23.5,19.4 23.05,11.43 23.95,11.43 24.4,11.43 25.45,10.3 26.25,10.3 25.45,9.86 26.25,9.86 25.85,9.86 25.85,10.3 18.93,17.43 19.38,17.43
  pour Route2: 7,5 27.55,5 27.55,35 7,35
  pour Top (rank 3, no thermals): 22.82,11.57 26.27,11.57 26.4,11.45 26.4,9.85 26.2,9.65 25.45,9.65 25.3,9.8 25.3,10.9 25,11.28 22.82,11.28
CARVIN  (via drill 0.2)
  Top 0.5: 15.25,15.5 REG5_C4.1 17.35,15.05 | 15.25,15.5 15.23,15.5 PL2.1 PL2.2 | D4.1 17.35,14.75 | 15.25,15.5 15.25,15.2 v15.7,14.75 17.35,14.75 | 17.35,14.75 17.35,15.05 | 17.35,15.05 15.55,15.05 | v26.95,6.35 26.32,6.35 25.7,6.97 | 25.7,6.97 25.7,7.5 26.2,7.5 | 26.2,7.5 27,7.5 27,6.4 v26.95,6.35 | v26.95,6.35 v26.05,6.35 25.7,6.7 25.7,6.97 | 26.35,6.65 26.95,6.65 26.95,6.95 25.75,6.95 25.73,6.97 25.7,6.97 | 26.2,7.5 L2.1
  Route15 1: v26.95,6.35 24.7,6.35 16.6,14.45 v16.6,14.75 v15.7,14.75
  Bottom 0.8: v16.6,14.75 v16.15,14.75 v15.7,14.75 | v26.95,6.35 v26.5,6.35 v26.05,6.35
CARVINFILT
  pour Top (rank 5, no thermals): 23.45,13.45 23.45,12.15 23.6,12 26.5,12 26.8,11.7 26.8,9.47 26.57,9.25 25.55,9.25 25.55,8.65 27.62,8.65 27.62,13.45
CR1  (via drill 0.2)
  Top 0.3: v45.85,22.85 45.85,25.25 44.5,26.6 RP1.2
  Bottom 0.3: QB1.3 v45.85,22.85
  pour Top (no thermals): 42.7,24.35 42.7,29.3 45.25,29.3 45.25,24.35
CR2  (via drill 0.2)
  Top 0.3: v49.6,22.85 49.6,25.25 48.25,26.6 RP2.2
  Bottom 0.3: QB2.3 v49.6,22.85
  pour Top (no thermals): 46.45,24.35 46.45,29.3 49,29.3 49,24.35
CR3  (via drill 0.2)
  Top 0.3: v53.35,22.85 53.35,25.4 52.45,26.3 51.8,26.3 RP3.2
  Bottom 0.3: QB3.3 v53.35,22.85
  pour Top (no thermals): 50.2,24.35 50.2,29.3 52.75,29.3 52.75,24.35
CR4  (via drill 0.2)
  Top 0.3: v57.1,22.7 57.1,25.4 56.2,26.3 55.55,26.3 RP4.2
  Bottom 0.3: QB4.3 v57.1,22.7
  pour Top (no thermals): 53.95,24.35 53.95,29.3 56.5,29.3 56.5,24.35
CR5  (via drill 0.2)
  Top 0.3: v60.85,22.7 60.85,25.25 59.8,26.3 59.3,26.3 RP5.2
  Bottom 0.3: QB5.3 v60.85,22.7
  pour Top (no thermals): 57.7,24.35 57.7,29.3 60.25,29.3 60.25,24.35
CR6  (via drill 0.2)
  Top 0.3: v64.6,22.7 64.6,25.1 63.4,26.3 63.05,26.3 RP6.2
  Bottom 0.3: QB6.3 64.65,22.75 v64.6,22.7
  pour Top (no thermals): 61.45,24.35 61.45,29.3 64,29.3 64,24.35
CR7  (via drill 0.2)
  Top 0.3: v68.35,22.7 68.35,25.25 67.3,26.3 66.8,26.3 RP7.2
  Bottom 0.3: QB7.3 v68.35,22.7
  pour Top (no thermals): 65.2,24.35 65.2,29.3 67.75,29.3 67.75,24.35
CR8  (via drill 0.2)
  Top 0.3: v72.1,22.55 72.1,25.25 71.05,26.3 70.55,26.3 RP8.2
  Bottom 0.3: QB8.3 72.05,22.6 v72.1,22.55
  pour Top (no thermals): 68.95,24.35 68.95,29.3 71.5,29.3 71.5,24.35
CR9  (via drill 0.2)
  Top 0.3: v75.85,22.7 75.85,25.25 74.8,26.3 74.3,26.3 RP9.2
  Bottom 0.3: QB9.3 75.9,22.75 v75.85,22.7
  pour Top (no thermals): 72.7,24.35 72.7,29.3 75.25,29.3 75.25,24.35
CR10  (via drill 0.2)
  Top 0.3: v79.6,16.55 79.6,25.25 78.55,26.3 78.05,26.3 RP10.2
  Bottom 0.3: QB10.3 79.45,17.45 79.6,17.3 v79.6,16.55
  pour Top (no thermals): 76.45,24.35 76.45,29.3 79,29.3 79,24.35
CR11  (via drill 0.2)
  Top 0.3: v83.05,17.6 83.05,19.55 82.15,20.45 81.65,20.45 RP11.2
  Bottom 0.3: QB11.3 82.3,17.6 v83.05,17.6
  pour Top (no thermals): 80.2,18.35 80.2,23.3 82.75,23.3 82.75,18.35
CR12  (via drill 0.2)
  Top 0.3: v85.75,17.45 85.75,20.1 RP12.2
  Bottom 0.3: QB12.3 85.2,17.7 85.45,17.45 v85.75,17.45
  pour Top (no thermals): 83.95,18.35 83.95,23.3 86.5,23.3 86.5,18.35
CSB  (via drill 0.2)
  Top 0.2: IC2.44 52.86,6.24 v53.5,5.6
  Bottom 0.2: R1.2 53.74,5.84 v53.5,5.6
FB1  (via drill 0.2)
  Top 0.3: IC3.3 24.6,9.4 v24.4,9.2
  Bottom 0.3: REG5_R2.1 v24.4,9.2 24.4,10.15 REG5_R1.2
FSM  (via drill 0.2)
  Top 0.2: IC2.29 45.36,6.11 v45.1,5.85 | C2.1 R60.2 v40.3,7.55 39.55,8.3 39.55,13.4 40,13.85 40.9,13.85 41.5,14.45 41.5,15.65 42.1,16.25 R59.1
  Bottom 0.2: v40.3,7.55 40.3,7.85 40.75,8.3 44.8,8.3 45.25,7.85 45.25,7 CFSM.2
  Bottom 0.3: CFSM.2 45.3,6.05 v45.1,5.85
GND  (via drill 0.2)
  Top 0.2: IC2.27 v44.36,5.85 | IC2.33 47.36,6.4 v47.86,5.9 | IC2.34 v47.86,5.9 | IC2.35 48.36,6.4 v47.86,5.9 | IC2.36 48.86,6.4 v49.36,5.9 | IC2.37 v49.36,5.9 | IC2.38 49.86,6.4 v49.36,5.9 | IC2.40 50.86,6.15 v50.61,5.9 50.36,6.15 IC2.39
  Top 0.27: IC1.5 v34,30.41 v34.45,30.41 | IC1.41 37.51,32.99 37.75,32.75 v37.81,32.75 v37.81,32.3
  Top 0.3: J1.6 33.93,10.47 34,10.4 v34,11.75
  Top 0.5: U$2.P$15 37.88,21.82 C27.2 38.23,21.73 C5.2 v39.67,20.9 v39.67,20.45 v39.67,20 | U$2.P$11 v37.6,16.74 v38.05,16.74 | U$2.P$9 v37.6,14.21 v38.05,14.21 | v42.7,20.75 v42.7,20.3 v42.7,19.85 42.7,18.65 43,18.35 V-R.2 43,17.9 43.75,17.15 50.05,17.15 50.38,17.48 C1.2 | v38.05,5.85 v38.5,5.85 C2.2 R60.1 | D1.A 68.07,12.79 v68.05,12.8 | v67.6,12.8 v68.05,12.8 | Q2.2 68.22,12.96 v68.05,12.8
  Bottom 0.15: C15.1 v35.8,29.15 | C14.1 v36.85,29.15 | C34.2 34.2,26.95 34.6,27.35 v34.6,27.65 | RGQ1_3.1 66.58,12.82 66.55,12.8 | R11.1 38.23,22.35 v39.67,20.9 | DT11.3 81.5,21.7
  Bottom 0.27: C22.2 37.65,33.59 37.81,33.42 v37.81,32.3 | C23.2 33.09,30.25 33.25,30.41 v34.45,30.41
  Bottom 0.3: NTC_C1.2 40.25,33.75 v40.6,34.1 | NTC_C4.2 39.7,32 v39.4,31.7 | NTC_C3.2 v39.4,30.95 | NTC_C2.2 v39.4,29.9 | CFSM.1 44.3,5.91 v44.36,5.85 | CVREF.1 CVREG.1 48.3,6.34 v47.86,5.9 | C3.2 v41.05,26.15 | DT12.3 DT11.3 | 81.5,21.7 80.8,22.4 80.8,26.15 79.3,27.65 DT10.3 DT9.3 DT8.3 DT7.3 DT6.3 DT5.3 DT4.3 DT3.3 | DT3.3 DT2.3 DT1.3 | DT3.3 51.5,30.8 X1.3
  Bottom 0.5: v68.05,12.8 v67.6,12.8 66.55,12.8 55.15,12.8 54.25,11.9 v54.25,10.4 v54.25,9.95 v54.25,9.5
  pour Route2: 31.9,5 55.45,5 55.45,10.55 40.45,10.55 39.1,11.9 39.1,15.8 43.45,20.15 43.45,23.75 42.25,23.75 42.25,30.35 43.45,30.35 59.8,30.35 59.8,35 31.9,35
ISP_CAN  (via drill 0.2)
  Top 0.15: IC1.14 34.51,24.74 35.05,24.2 v36.5,24.2
  Bottom 0.15: R11.2 v36.5,24.2
ISP_ENTER  (via drill 0.2)
  Top 0.15: J1.5 36.48,10.47 36.1,10.85 36.1,12.05 32.8,15.35 32.8,23.75 v33.4,24.35 | v36.1,27.95 36.55,27.95 37.45,28.85 37.45,29.45 35.99,30.91 IC1.4
  Bottom 0.15: R15.2 33.81,23.94 v33.4,24.35 34.3,24.35 36.85,26.9 36.85,27.65 36.55,27.95 v36.1,27.95
LED1
  Top 0.15: LED1.C 39.1,18.5 39.4,18.8 41.2,18.8 41.8,19.4 41.8,23.9 41.2,24.5 39.25,24.5 39.01,24.74 IC1.23
LED2
  Top 0.15: LED2.C 40.95,18.1 42.1,19.25 42.1,24.05 41.35,24.8 39.55,24.8 39.51,24.84 IC1.24
MISO  (via drill 0.2)
  Top 0.15: IC1.26 40.09,27.41 39.85,27.65 v39.85,28.1
  Bottom 0.15: R4.1 52.72,8.03 51.4,9.35 39.4,9.35 35.5,13.25 35.5,24.65 37.45,26.6 37.45,28.1 37.8,28.45 38.3,28.45 38.65,28.1 v39.85,28.1
MOSI  (via drill 0.2)
  Top 0.15: IC1.38 v39.01,32.45
  Bottom 0.15: R5.1 51.7,8.3 50.95,9.05 39.25,9.05 35.2,13.1 35.2,24.8 37.15,26.75 37.15,28.25 37.75,28.85 37.75,31.19 v39.01,32.45
N$1
  Top 0.2: R8.1 LED2.A
N$2
  Top 0.5: IC5.7 18.52,26.64 19.45,25.7 24.85,25.7 25.78,26.63 L11.4
N$3  (via drill 0.2)
  Top 0.3: Q2.3 70.31,15.51 70.15,15.35 v70.15,14.3
  Bottom 0.3: RGQ1_2.1 70.99,14.21 70.9,14.3 v70.15,14.3
N$4
  Top 0.5: L7.2 73.59,12.78 V+R.1
N$5
  Top 0.2: R2.1 LED1.A
N$6
  Top 0.5: IC5.6 19.79,26.71 20.05,26.45 24.25,26.45 24.53,26.73 L11.3
N$7
  cutout Route15: 19.6,24.35 19.45,24.2 19.45,23.45 19.6,23.3 19.98,23.3 20.15,23.48 20.15,24.2 20,24.35
N$8
  cutout Route15: 35.98,32.88 35.98,32.15 36.15,31.98 36.45,31.98 36.65,32.17 36.65,32.88 36.45,33.08 36.17,33.08
  cutout Route15: 33.88,28.57 34.6,28.57 34.77,28.75 34.77,29.05 34.58,29.25 33.88,29.25 33.67,29.05 33.67,28.77
N$9
  cutout Route15: 21.85,17 22.9,17 23.8,16.1 23.8,14.9 22.9,14 21.85,14 20.95,14.9 20.95,16.1
  cutout Route2: 21.85,17 22.9,17 23.8,16.1 23.8,14.9 22.9,14 21.85,14 20.95,14.9 20.95,16.1
Q1G  (via drill 0.2)
  Top 0.3: Q1.1 76.75,17.3 75.7,18.35 73.38,18.35 D2.A 72.51,17.86 71.95,17.3 v71.95,15.8
  Bottom 0.3: RGQ1_2.2 RGQ1_1.2 72.04,15.71 v71.95,15.8
QBG1
  Bottom 0.15: RBG1.1 40.6,15.5 45.1,20 45.1,24.75 QB1.1
QBG2
  Bottom 0.15: RBG2.1 41.65,15.95 45.55,19.85 48.1,19.85 48.85,20.6 48.85,24.75 QB2.1
QBG3
  Bottom 0.15: RBG3.1 42.7,16.55 45.7,19.55 51.55,19.55 52.75,20.75 52.75,24.9 QB3.1
QBG4
  Bottom 0.15: RBG4.1 43.75,17.15 45.85,19.25 55,19.25 56.5,20.75 56.5,24.9 QB4.1
QBG5
  Bottom 0.15: RBG5.1 44.8,17.75 46,18.95 58.45,18.95 60.25,20.75 60.25,24.9 QB5.1
QBG6
  Bottom 0.15: RBG6.1 45.85,17.75 46.75,18.65 61.75,18.65 63.7,20.6 63.7,24.55 QB6.1
QBG7
  Bottom 0.15: RBG7.1 46.9,17.3 47.95,18.35 65.05,18.35 67.6,20.9 67.6,24.75 QB7.1
QBG8
  Bottom 0.15: RBG8.1 47.95,16.85 49.15,18.05 68.35,18.05 71.2,20.9 71.2,24.65 QB8.1
QBG9
  Bottom 0.15: RBG9.1 49,16.4 50.35,17.75 71.95,17.75 75.1,20.9 75.1,24.7 QB9.1
QBG10
  Bottom 0.15: RBG10.1 50.05,16.1 51.4,17.45 75.25,17.45 76.6,18.8 78.85,18.8 78.85,18.95 79,18.9 QB10.1
QBG11
  Bottom 0.15: RBG11.1 51.1,15.8 52.45,17.15 77.5,17.15 80.5,14.15 81.4,14.15 81.7,14.45 81.7,18.95 QB11.1
QBG12
  Bottom 0.15: RBG12.1 52.15,15.5 53.5,16.85 77.35,16.85 80.35,13.85 84.55,13.85 85.15,14.45 85.15,15.05 84.4,15.8 84.4,18.75 QB12.1
RS1  (via drill 0.2)
  Top 0.2: IC5.8 16.5,27.8 v14.62,25.93
  Bottom 0.2: 14.61,25.91 v14.62,25.93 13.79,25.09 R39.1
RTEMP  (via drill 0.2)
  Top 0.15: IC1.30 39.66,29.41 39.25,29 v39.1,29
  Bottom 0.15: C3.1 41,28 40,29 v39.1,29
  Bottom 0.3: R9.1 39.55,26.9 40.65,28 C3.1 41.45,28 43.1,26.35 DT1.1 DT2.1 DT3.1 DT4.1 DT5.1 DT6.1 DT7.1 DT8.1 DT9.1 DT10.1 79.4,26.35 80.2,25.55 80.2,21.05 80.9,20.35 DT11.1 DT12.1
SCK  (via drill 0.2)
  Top 0.2: IC2.41 51.36,5.71 v51.25,5.6
  Bottom 0.2: R3.2 50.68,6.88 51.36,6.2 51.36,5.71 v51.25,5.6
SCK1  (via drill 0.2)
  Top 0.15: IC1.13 34.01,24.49 v34.6,23.9
  Bottom 0.15: R3.1 50.68,8.27 50.2,8.75 39.1,8.75 34.9,12.95 34.9,23.6 v34.6,23.9
SDI  (via drill 0.2)
  Top 0.2: IC2.42 51.86,5.74 v52,5.6
  Bottom 0.2: R5.2 51.77,6.98 IC2.42 51.86,5.74 v52,5.6
SDO  (via drill 0.2)
  Top 0.2: v52.75,5.6 52.36,5.99 IC2.43 52.36,8.09 52.6,8.3 53.35,8.3 53.6,8.05 R19.1
  Bottom 0.2: R4.2 52.72,6.94 52.36,6.58 52.36,5.99 v52.75,5.6
SSEL  (via drill 0.2)
  Top 0.15: v38.05,27.95 38.05,29.75 35.89,31.91 IC1.2
  Bottom 0.15: R1.1 53.74,8.06 52.15,9.65 39.55,9.65 35.8,13.4 35.8,24.5 37.75,26.45 37.75,27.65 v38.05,27.95
SW1  (via drill 0.2)
  Bottom 0.3: REG5_C2.2 v21.4,13.1
  pour Top (rank 6, no thermals): 18.85,12 22.75,12 22.9,12.15 22.9,13.85 23.05,14 23.85,14 23.85,14.8 19.05,14.8 18.85,14.6
SWCLK
  Top 0.15: J1.4 34.75,9.2 35.2,9.65 35.2,11.6 31.9,14.9 31.9,25.1 32.95,26.15 33.55,26.15 33.7,26.3 37.75,26.3 38.95,27.5 38.95,28.1 39.76,28.91 IC1.29
SWDIO  (via drill 0.2)
  Top 0.15: J1.3 36.25,9.2 35.8,9.65 35.8,11.9 32.5,15.2 32.5,24.2 33.25,24.95 v33.25,25.65 | v32.05,26.15 32.35,26.45 33.4,26.45 33.55,26.6 37.52,26.6 38.59,27.66 38.58,27.68 38.58,32.1 38.51,32.16 IC1.39
  Bottom 0.15: v33.25,25.65 32.55,25.65 v32.05,26.15
V+  (via drill 0.2)
  Top 0.27: IC2.1 52.86,15.32 52.7,15.47
  Top 0.3: Q1.3 75.8,14.55 75.7,14.45 v74.8,14.45 v74.8,14 | v54.85,15.2 v54.55,15.5 52.6,17.45 52.32,17.45 C1.1
  Top 0.4: 52.7,15.47 52.15,16.02 R59.2
  Top 0.5: C1.1 R59.2
  Route2 0.3: v74.8,14.45 v74.8,14 74.8,12.8 73,11 59.05,11 v54.85,15.2 v54.55,15.5
  Bottom 0.3: v74.8,14.45 v74.8,14
V+S  (via drill 0.2)
  Top 0.3: V+R.2 72.08,13.68 72.55,14.15 v73.75,14.15 73.75,14.9 | D2.C 72.99,15.66 73.75,14.9 | Q1.2 74.85,16 73.75,14.9
  Top 0.5: V+R.2 D1.C
  Bottom 0.3: RGQ1_1.1 72.72,14.17 72.7,14.15 v73.75,14.15
VREF  (via drill 0.2)
  Top 0.2: IC2.31 46.36,6.29 46.45,6.2 v46.45,5.55
  Bottom 0.2: v46.45,5.55 46.45,7.55 46.75,7.85 CVREF.2
VREG  (via drill 0.2)
  Top 0.2: IC2.32 46.86,6.07 v47.05,5.88
  Bottom 0.2: CVREG.2 47.3,6.12 v47.05,5.88
XTALIN  (via drill 0.2)
  Top 0.15: IC1.6 34.91,29.91 v35.05,30.05
  Bottom 0.15: v35.05,30.05 35.05,30.65 | 35.05,30.65 34.6,31.1 32.05,31.1 31.9,31.25 31.9,33.05 32.52,33.67 Y1.2 | C15.2 35.1,30.7 35.05,30.65
XTALOUT  (via drill 0.2)
  Top 0.15: IC1.7 34.94,29.41 v35.05,29.3
  Bottom 0.15: v35.05,29.3 35.05,28.85 35.35,28.55 37,28.55 37.45,29 37.45,30.5 37.25,30.7 C14.2 36.85,31.1 36.7,31.25 35.92,31.25 Y1.1

## Text on the board
_tsilk: LV | o | WE-TVS | 10u | 1u | COIL | o | 1u | HV | WE-CBF | WE-PMI
_bsilk: o | o | o | canSlaveV04 - CC BY-NC-SA 2.0 / c David Brandt - david@wakka.de | 3.3k | HV | LV | o | 100n